# EAGLE design APA106_layout_test (EAGLE 7.4.0)
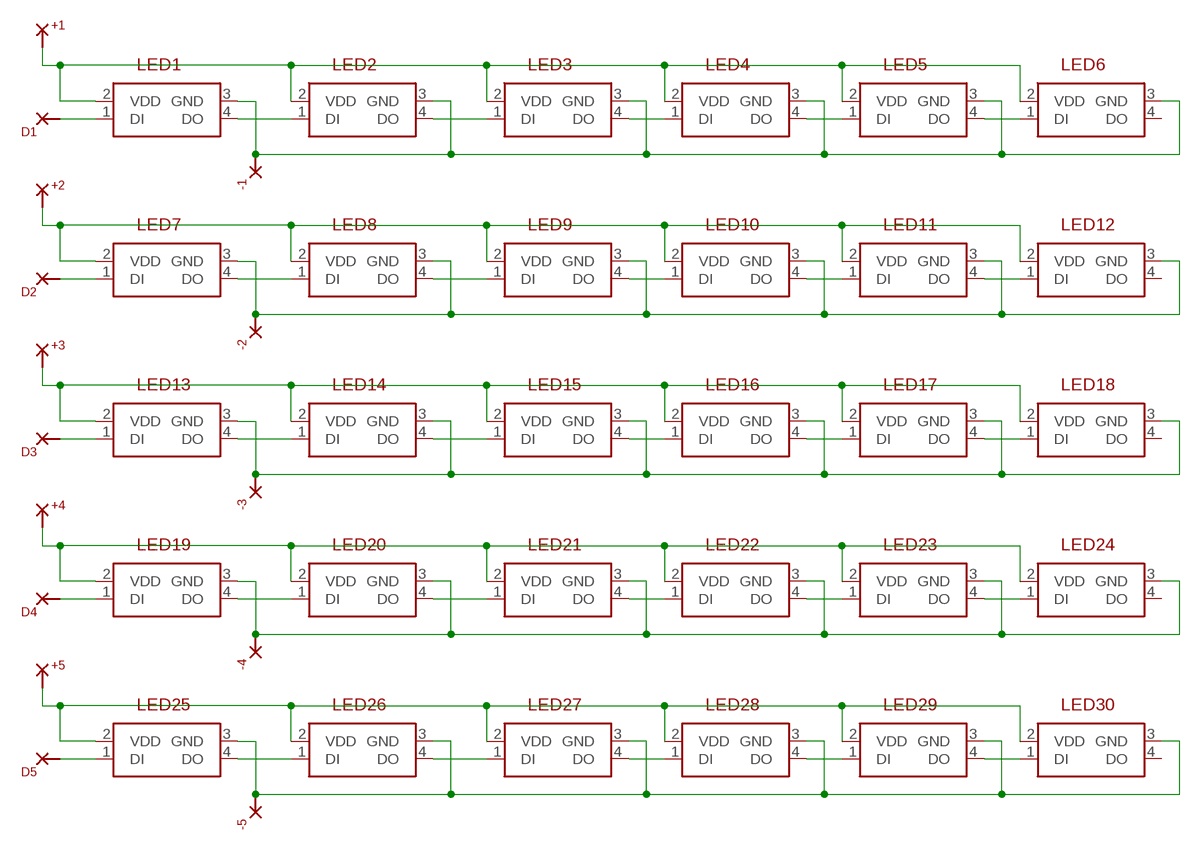
[diagram p0: schematic, sheet 1]

## Parts
+1  WIRE-TEST-LOOP  [WIRE-TEST-LOOP]
+2  WIRE-TEST-LOOP  [WIRE-TEST-LOOP]
+3  WIRE-TEST-LOOP  [WIRE-TEST-LOOP]
+4  WIRE-TEST-LOOP  [WIRE-TEST-LOOP]
+5  WIRE-TEST-LOOP  [WIRE-TEST-LOOP]
-1  WIRE-TEST-LOOP  [WIRE-TEST-LOOP]
-2  WIRE-TEST-LOOP  [WIRE-TEST-LOOP]
-3  WIRE-TEST-LOOP  [WIRE-TEST-LOOP]
-4  WIRE-TEST-LOOP  [WIRE-TEST-LOOP]
-5  WIRE-TEST-LOOP  [WIRE-TEST-LOOP]
D1  WIRE-TEST-LOOP  [WIRE-TEST-LOOP]
D2  WIRE-TEST-LOOP  [WIRE-TEST-LOOP]
D3  WIRE-TEST-LOOP  [WIRE-TEST-LOOP]
D4  WIRE-TEST-LOOP  [WIRE-TEST-LOOP]
D5  WIRE-TEST-LOOP  [WIRE-TEST-LOOP]
LED1  LED-APA106HOLE-OFFSET-SPREAD  [LED-5MM-4PIN-HOLE-OFFSET-SPREAD]
LED2  LED-APA106HOLE-OFFSET-SPREAD  [LED-5MM-4PIN-HOLE-OFFSET-SPREAD]
LED3  LED-APA106HOLE-OFFSET-SPREAD  [LED-5MM-4PIN-HOLE-OFFSET-SPREAD]
LED4  LED-APA106HOLE-OFFSET-SPREAD  [LED-5MM-4PIN-HOLE-OFFSET-SPREAD]
LED5  LED-APA106HOLE-OFFSET-SPREAD  [LED-5MM-4PIN-HOLE-OFFSET-SPREAD]
LED6  LED-APA106HOLE-OFFSET-SPREAD  [LED-5MM-4PIN-HOLE-OFFSET-SPREAD]
LED7  LED-APA106SPREAD  [LED-5MM-4PIN-SPREAD]
LED8  LED-APA106SPREAD  [LED-5MM-4PIN-SPREAD]
LED9  LED-APA106SPREAD  [LED-5MM-4PIN-SPREAD]
LED10  LED-APA106SPREAD  [LED-5MM-4PIN-SPREAD]
LED11  LED-APA106SPREAD  [LED-5MM-4PIN-SPREAD]
LED12  LED-APA106SPREAD  [LED-5MM-4PIN-SPREAD]
LED13  LED-APA106OFFSET  [LED-5MM-4PIN-OFFSET]
LED14  LED-APA106OFFSET  [LED-5MM-4PIN-OFFSET]
LED15  LED-APA106OFFSET  [LED-5MM-4PIN-OFFSET]
LED16  LED-APA106OFFSET  [LED-5MM-4PIN-OFFSET]
LED17  LED-APA106OFFSET  [LED-5MM-4PIN-OFFSET]
LED18  LED-APA106OFFSET  [LED-5MM-4PIN-OFFSET]
LED19  LED-APA106SPREAD-OFFSET  [LED-5MM-4PIN-SPREAD-OFFSET]
LED20  LED-APA106SPREAD-OFFSET  [LED-5MM-4PIN-SPREAD-OFFSET]
LED21  LED-APA106SPREAD-OFFSET  [LED-5MM-4PIN-SPREAD-OFFSET]
LED22  LED-APA106SPREAD-OFFSET  [LED-5MM-4PIN-SPREAD-OFFSET]
LED23  LED-APA106SPREAD-OFFSET  [LED-5MM-4PIN-SPREAD-OFFSET]
LED24  LED-APA106SPREAD-OFFSET  [LED-5MM-4PIN-SPREAD-OFFSET]
LED25  LED-APA106HOLE-OFFSET  [LED-5MM-4PIN-HOLE-OFFSET]
LED26  LED-APA106HOLE-OFFSET  [LED-5MM-4PIN-HOLE-OFFSET]
LED27  LED-APA106HOLE-OFFSET  [LED-5MM-4PIN-HOLE-OFFSET]
LED28  LED-APA106HOLE-OFFSET  [LED-5MM-4PIN-HOLE-OFFSET]
LED29  LED-APA106HOLE-OFFSET  [LED-5MM-4PIN-HOLE-OFFSET]
LED30  LED-APA106HOLE-OFFSET  [LED-5MM-4PIN-HOLE-OFFSET]

## Nets
DI-SPREAD: D2.HOLE1 D2.HOLE2 D2.PAD LED7.1(DI)
DI-SPREAD1: D3.HOLE1 D3.HOLE2 D3.PAD LED13.1(DI)
DI-SPREAD2: D4.HOLE1 D4.HOLE2 D4.PAD LED19.1(DI)
DI-SPREAD3: D5.HOLE1 D5.HOLE2 D5.PAD LED25.1(DI)
DI-STANDARD: D1.HOLE1 D1.HOLE2 D1.PAD LED1.1(DI)
GND1: -1.HOLE1 -1.HOLE2 -1.PAD LED1.3(GND) LED2.3(GND) LED3.3(GND) LED4.3(GND) LED5.3(GND) LED6.3(GND)
GND2: -2.HOLE1 -2.HOLE2 -2.PAD LED7.3(GND) LED8.3(GND) LED9.3(GND) LED10.3(GND) LED11.3(GND) LED12.3(GND)
GND3: -3.HOLE1 -3.HOLE2 -3.PAD LED13.3(GND) LED14.3(GND) LED15.3(GND) LED16.3(GND) LED17.3(GND) LED18.3(GND)
GND4: -4.HOLE1 -4.HOLE2 -4.PAD LED19.3(GND) LED20.3(GND) LED21.3(GND) LED22.3(GND) LED23.3(GND) LED24.3(GND)
N$1: LED1.4(DO) LED2.1(DI)
N$3: LED7.4(DO) LED8.1(DI)
N$4: LED2.4(DO) LED3.1(DI)
N$5: LED3.4(DO) LED4.1(DI)
N$6: LED4.4(DO) LED5.1(DI)
N$7: LED5.4(DO) LED6.1(DI)
N$8: LED13.4(DO) LED14.1(DI)
N$9: LED8.4(DO) LED9.1(DI)
N$10: LED9.4(DO) LED10.1(DI)
N$11: LED10.4(DO) LED11.1(DI)
N$12: LED11.4(DO) LED12.1(DI)
N$13: LED14.4(DO) LED15.1(DI)
N$15: LED15.4(DO) LED16.1(DI)
N$16: LED16.4(DO) LED17.1(DI)
N$17: LED17.4(DO) LED18.1(DI)
N$19: LED19.4(DO) LED20.1(DI)
N$20: LED20.4(DO) LED21.1(DI)
N$21: LED21.4(DO) LED22.1(DI)
N$22: LED22.4(DO) LED23.1(DI)
N$23: LED23.4(DO) LED24.1(DI)
N$25: LED25.4(DO) LED26.1(DI)
N$26: LED26.4(DO) LED27.1(DI)
N$27: LED27.4(DO) LED28.1(DI)
N$28: LED28.4(DO) LED29.1(DI)
N$29: LED29.4(DO) LED30.1(DI)
VDD1: +1.HOLE1 +1.HOLE2 +1.PAD LED1.2(VDD) LED2.2(VDD) LED3.2(VDD) LED4.2(VDD) LED5.2(VDD) LED6.2(VDD)
VDD2: +2.HOLE1 +2.HOLE2 +2.PAD LED7.2(VDD) LED8.2(VDD) LED9.2(VDD) LED10.2(VDD) LED11.2(VDD) LED12.2(VDD)
VDD3: +3.HOLE1 +3.HOLE2 +3.PAD LED13.2(VDD) LED14.2(VDD) LED15.2(VDD) LED16.2(VDD) LED17.2(VDD) LED18.2(VDD)
VDD4: +4.HOLE1 +4.HOLE2 +4.PAD LED19.2(VDD) LED20.2(VDD) LED21.2(VDD) LED22.2(VDD) LED23.2(VDD) LED24.2(VDD)
VDD5: +5.HOLE1 +5.HOLE2 +5.PAD LED25.2(VDD) LED26.2(VDD) LED27.2(VDD) LED28.2(VDD) LED29.2(VDD) LED30.2(VDD)
VND5: -5.HOLE1 -5.HOLE2 -5.PAD LED25.3(GND) LED26.3(GND) LED27.3(GND) LED28.3(GND) LED29.3(GND) LED30.3(GND)
Unconnected: LED6.4(DO) LED12.4(DO) LED18.4(DO) LED24.4(DO) LED30.4(DO)

## Library data of the parts
+1-+5 -1--5 D1-D5 = scotty:WIRE-TEST-LOOP
LED1-LED30 = scotty:LED-APA106

## Board
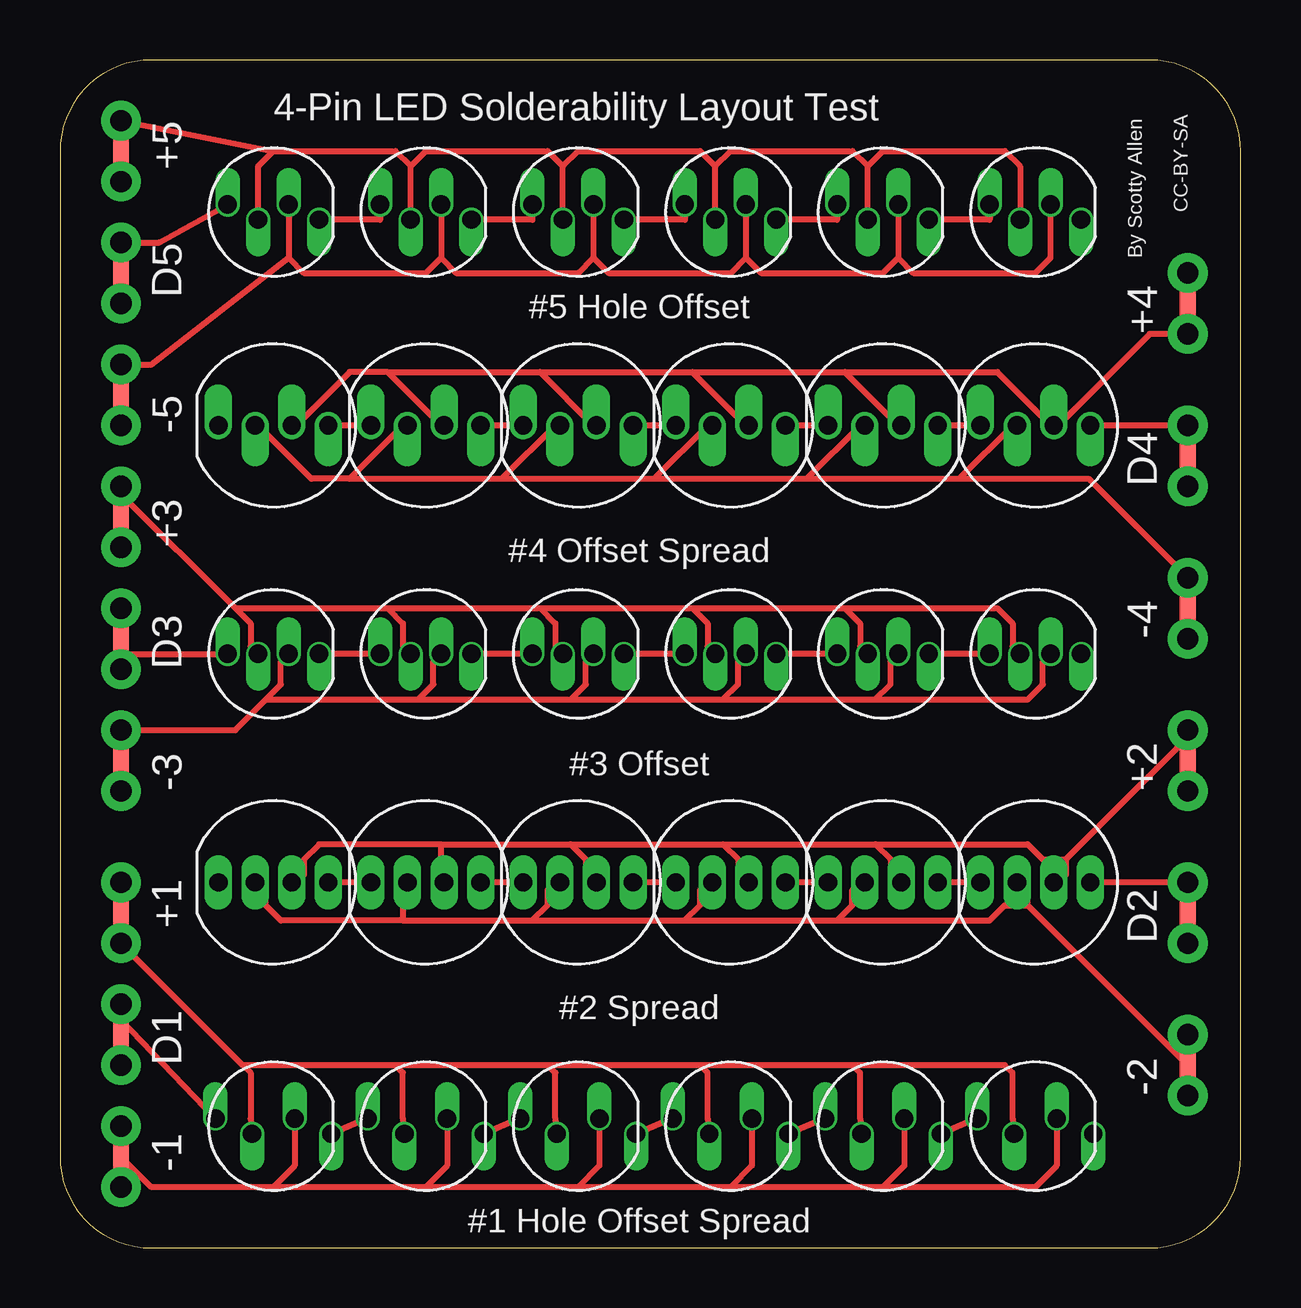
[diagram p1: board, top side]
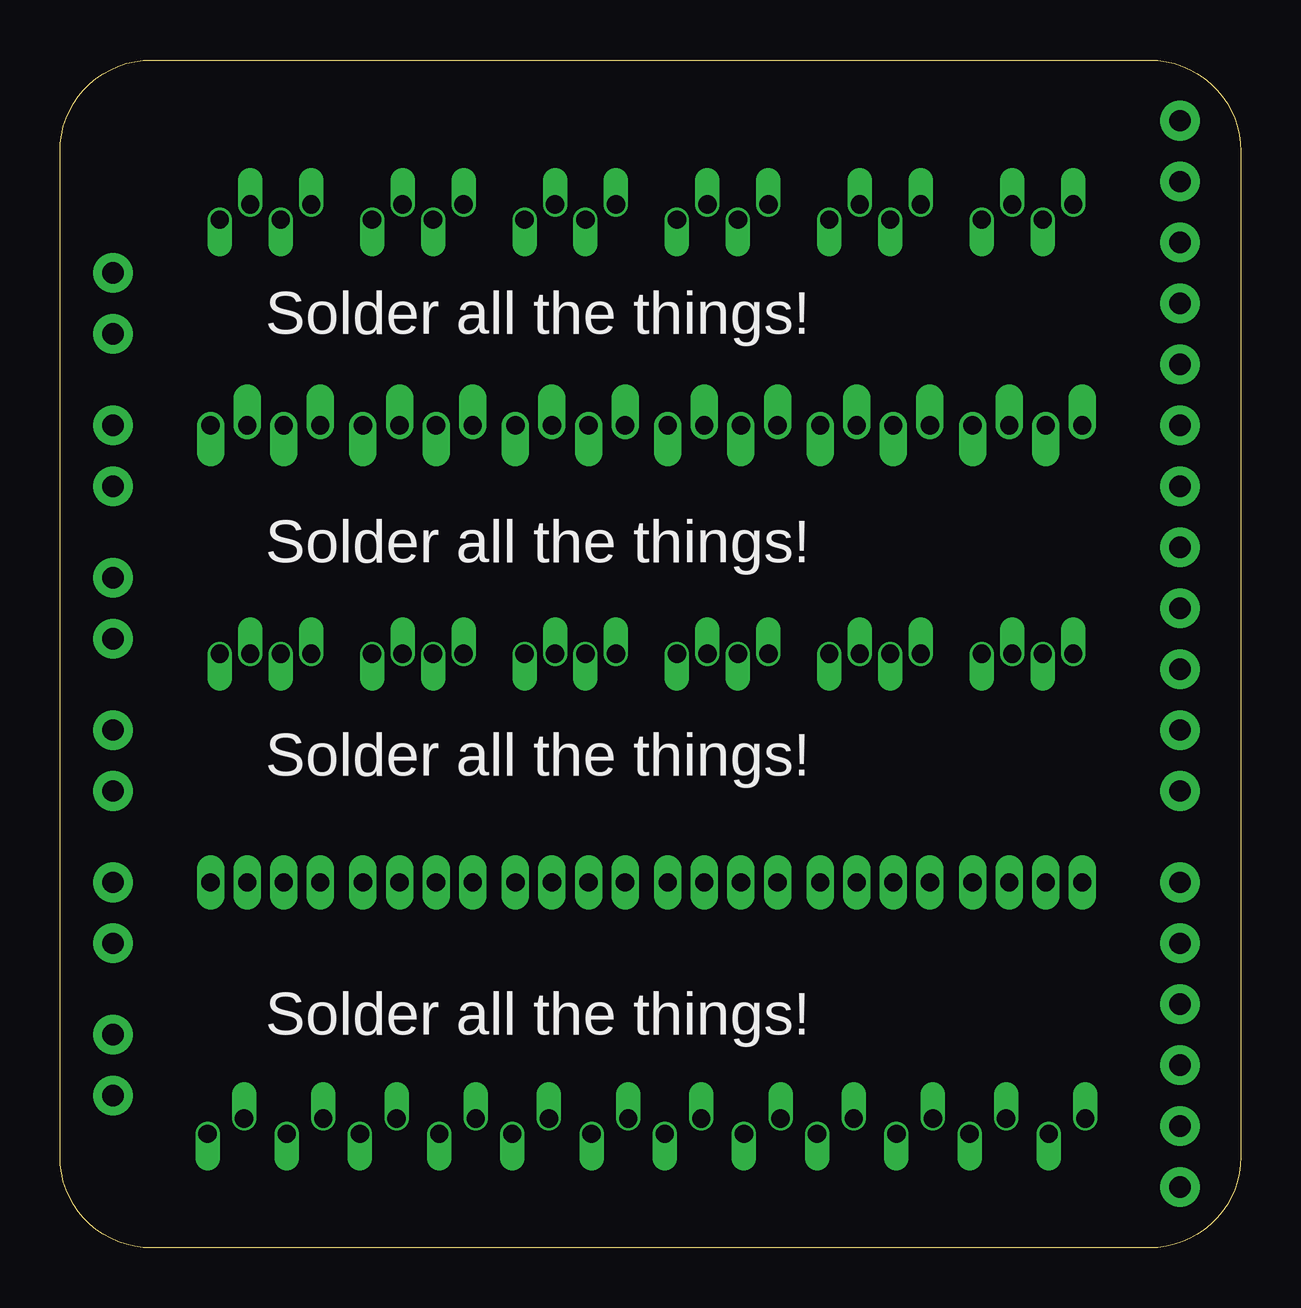
[diagram p2: board, bottom side, seen from below]

Size 49.2 x 49.52 mm. Coordinates in mm from the lower left corner, seen from the top.
Outline: 49.2,3.81 49.2,45.71 arc90 45.39,49.52 3.81,49.52 arc90 0,45.71 0,3.81 arc90 3.81,0 45.39,0 arc90 49.2,3.81
Copper layers (1*16): Top 0.035mm / dielectric 1.5mm / Bottom 0.035mm
Design rules "default *": minimum track width 10mil, minimum drill 24mil, track to track 8mil, track to pad 8mil, pad to pad 8mil, via to via 8mil, smd to smd 8mil, copper to edge 40mil, drill to drill 8mil, minimum pad ring 4mil, minimum via ring 8mil, stop-mask expansion 4mil, vias tented up to drill 0mil, thermal gap 10mil

### Footprints (pad centres in the part's own frame; a part is rotated, then mirrored left to right if it is on the bottom)
WIRE-TEST-LOOP = drill 0.889 pad 1.651: HOLE1 -1.27,0; HOLE2 1.27,0 | smd 1.27 x 0.66: PAD 0,0
LED-5MM-4PIN-HOLE-OFFSET-SPREAD = drill 0.762 pad 1.016 offset: 1 -2.413,0.318; 2 -0.889,-0.318; 3 0.889,0.318; 4 2.413,-0.318
LED-5MM-4PIN-SPREAD = drill 0.762 pad 1.143 long: 1 -2.286,0; 2 -0.762,0; 3 0.762,0; 4 2.286,0
LED-5MM-4PIN-OFFSET = drill 0.762 pad 1.016 offset: 1 -1.905,0; 2 -0.635,0; 3 0.635,0; 4 1.905,0
LED-5MM-4PIN-SPREAD-OFFSET = drill 0.762 pad 1.143 offset: 1 -2.286,0; 2 -0.762,0; 3 0.762,0; 4 2.286,0
LED-5MM-4PIN-HOLE-OFFSET = drill 0.762 pad 1.016 offset: 1 -1.905,0.318; 2 -0.635,-0.318; 3 0.635,0.318; 4 1.905,-0.318

### Placement (x,y rotation side)
+1  2.54,13.97 270 top
+2  46.99,20.32 90 top
+3  2.54,30.48 90 top
+4  46.99,39.37 90 top
+5  2.54,45.72 270 top
-1  2.54,3.81 270 top
-2  46.99,7.62 90 top
-3  2.54,20.32 90 top
-4  46.99,26.67 90 top
-5  2.54,35.56 270 top
D1  2.54,8.89 270 top
D2  46.99,13.97 90 top
D3  2.54,25.4 90 top
D4  46.99,33.02 90 top
D5  2.54,40.64 270 top
LED1  8.89,5.08 0 top
LED2  15.24,5.08 0 top
LED3  21.59,5.08 0 top
LED4  27.94,5.08 0 top
LED5  34.29,5.08 0 top
LED6  40.64,5.08 0 top
LED7  40.64,15.24 180 top
LED8  34.29,15.24 180 top
LED9  27.94,15.24 180 top
LED10  21.59,15.24 180 top
LED11  15.24,15.24 180 top
LED12  8.89,15.24 180 top
LED13  8.89,24.77 0 top
LED14  15.24,24.77 0 top
LED15  21.59,24.77 0 top
LED16  27.94,24.77 0 top
LED17  34.29,24.77 0 top
LED18  40.64,24.77 0 top
LED19  40.64,34.29 180 top
LED20  34.29,34.29 180 top
LED21  27.94,34.29 180 top
LED22  21.59,34.29 180 top
LED23  15.24,34.29 180 top
LED24  8.89,34.29 180 top
LED25  8.89,43.18 0 top
LED26  15.24,43.18 0 top
LED27  21.59,43.18 0 top
LED28  27.94,43.18 0 top
LED29  34.29,43.18 0 top
LED30  40.64,43.18 0 top

### Tracks (layer width: path | path; a pad name or v marks a point on that pad's centre or on a via)
DI-SPREAD
  Top 0.254: LED7.1 D2.HOLE2 D2.PAD D2.HOLE1
DI-SPREAD1
  Top 0.254: D3.HOLE2 D3.PAD 2.54,24.77 | 2.54,24.77 LED13.1 | 2.54,24.77 D3.HOLE1
DI-SPREAD2
  Top 0.254: LED19.1 D4.HOLE2 D4.PAD D4.HOLE1
DI-SPREAD3
  Top 0.254: D5.HOLE2 D5.PAD D5.HOLE1 4.13,41.91 LED25.1
DI-STANDARD
  Top 0.254: 2.54,9.53 D1.PAD D1.HOLE2 | 2.54,9.53 LED1.1 | 2.54,9.53 D1.HOLE1
GND1
  Top 0.254: -1.HOLE1 -1.PAD | -1.PAD -1.HOLE2 | LED1.3 9.78,3.43 8.89,2.54 | 8.89,2.54 3.81,2.54 -1.PAD | LED2.3 16.13,3.43 15.24,2.54 | 15.24,2.54 8.89,2.54 | LED3.3 22.48,3.43 21.59,2.54 | 21.59,2.54 15.24,2.54 | LED4.3 28.83,3.43 27.94,2.54 | 27.94,2.54 21.59,2.54 | LED5.3 35.18,3.43 34.29,2.54 | 34.29,2.54 27.94,2.54 | LED6.3 41.53,3.43 40.64,2.54 34.29,2.54
GND2
  Top 0.254: -2.HOLE2 -2.PAD | 40.32,14.29 40.32,14.92 40.01,15.24 LED7.3 | -2.PAD 40.32,14.29 | -2.PAD -2.HOLE1 | 14.29,13.65 9.21,13.65 8.57,14.29 8.57,14.92 8.26,15.24 LED12.3 | 14.29,13.65 14.29,15.24 LED11.3 | 19.68,13.65 20.32,14.29 20.32,14.92 20.64,15.24 LED10.3 | 14.29,13.65 19.68,13.65 | 26.04,13.65 26.67,14.29 26.67,14.92 26.99,15.24 LED9.3 | 19.68,13.65 26.04,13.65 | 32.38,13.65 33.02,14.29 33.02,14.92 33.34,15.24 LED8.3 | 26.04,13.65 32.38,13.65 | 40.32,14.29 39.37,14.29 38.73,13.65 32.38,13.65
GND3
  Top 0.254: LED13.3 9.21,24.45 9.21,23.5 8.57,22.86 | 8.57,22.86 7.3,21.59 -3.HOLE2 -3.PAD -3.HOLE1 | LED14.3 15.56,24.45 15.56,23.5 14.92,22.86 | 8.57,22.86 14.92,22.86 | LED15.3 21.91,24.45 21.91,23.5 21.27,22.86 | 14.92,22.86 21.27,22.86 | LED16.3 28.26,24.45 28.26,23.5 27.62,22.86 | 21.27,22.86 27.62,22.86 | LED17.3 34.61,24.45 34.61,23.5 33.97,22.86 | 27.62,22.86 33.97,22.86 | LED18.3 40.96,24.45 40.96,23.5 40.32,22.86 33.97,22.86
GND4
  Top 0.254: -4.HOLE1 -4.PAD -4.HOLE2 42.86,32.07 37.47,32.07 | 12.06,32.07 10.48,32.07 8.26,34.29 LED24.3 | 12.06,32.07 14.29,34.29 LED23.3 | 18.41,32.07 20.64,34.29 LED22.3 | 12.06,32.07 18.41,32.07 | 24.77,32.07 26.99,34.29 LED21.3 | 18.41,32.07 24.77,32.07 | 31.11,32.07 33.34,34.29 LED20.3 | 24.77,32.07 31.11,32.07 | 37.47,32.07 39.69,34.29 LED19.3 | 31.11,32.07 37.47,32.07
N$1
  Top 0.254: LED2.1 LED1.4
N$3
  Top 0.254: LED7.4 LED8.1
N$4
  Top 0.254: LED3.1 LED2.4
N$5
  Top 0.254: LED4.1 LED3.4
N$6
  Top 0.254: LED5.1 LED4.4
N$7
  Top 0.254: LED6.1 LED5.4
N$8
  Top 0.254: LED14.1 LED13.4
N$9
  Top 0.254: LED8.4 LED9.1
N$10
  Top 0.254: LED9.4 LED10.1
N$11
  Top 0.254: LED10.4 LED11.1
N$12
  Top 0.254: LED11.4 LED12.1
N$13
  Top 0.254: LED15.1 LED14.4
N$15
  Top 0.254: LED16.1 LED15.4
N$16
  Top 0.254: LED17.1 LED16.4
N$17
  Top 0.254: LED18.1 LED17.4
N$19
  Top 0.254: LED19.4 LED20.1
N$20
  Top 0.254: LED20.4 LED21.1
N$21
  Top 0.254: LED21.4 LED22.1
N$22
  Top 0.254: LED22.4 LED23.1
N$23
  Top 0.254: LED23.4 LED24.1
N$25
  Top 0.254: LED25.4 13.34,42.86 LED26.1
N$26
  Top 0.254: LED26.4 19.68,42.86 LED27.1
N$27
  Top 0.254: LED27.4 26.04,42.86 LED28.1
N$28
  Top 0.254: LED28.4 32.38,42.86 LED29.1
N$29
  Top 0.254: LED29.4 38.73,42.86 LED30.1
VDD1
  Top 0.254: +1.HOLE1 +1.PAD +1.HOLE2 7.62,7.62 | LED1.2 7.94,5.4 7.94,7.3 7.62,7.62 | LED2.2 14.29,5.4 14.29,7.3 13.97,7.62 | LED3.2 20.64,5.4 20.64,7.3 20.32,7.62 | LED4.2 26.99,5.4 26.99,7.3 26.67,7.62 | LED5.2 33.34,5.4 33.34,7.3 33.02,7.62 | LED6.2 39.69,5.4 39.69,7.3 39.37,7.62 33.02,7.62 | 13.97,7.62 7.62,7.62 | 20.32,7.62 13.97,7.62 | 26.67,7.62 20.32,7.62 | 33.02,7.62 31.75,7.62 26.67,7.62
VDD2
  Top 0.254: 46.99,21.27 +2.PAD +2.HOLE1 | 41.91,16.19 41.91,15.56 41.59,15.24 LED7.2 | 46.99,21.27 41.91,16.19 | 46.99,21.27 +2.HOLE2 | 15.88,16.83 10.79,16.83 10.16,16.19 10.16,15.56 9.84,15.24 LED12.2 | 15.88,16.83 15.88,15.24 LED11.2 | 21.27,16.83 21.91,16.19 21.91,15.56 22.23,15.24 LED10.2 | 15.88,16.83 21.27,16.83 | 27.62,16.83 28.26,16.19 28.26,15.56 28.57,15.24 LED9.2 | 21.27,16.83 27.62,16.83 | 33.97,16.83 34.61,16.19 34.61,15.56 34.92,15.24 LED8.2 | 27.62,16.83 33.97,16.83 | 41.91,16.19 40.96,16.19 40.32,16.83 33.97,16.83
VDD3
  Top 0.254: 2.54,31.43 +3.PAD +3.HOLE1 | LED13.2 7.94,25.08 7.94,26.04 7.3,26.67 | 2.54,31.43 7.3,26.67 | 2.54,31.43 +3.HOLE2 | LED14.2 14.29,25.08 14.29,26.04 13.65,26.67 | 7.3,26.67 13.65,26.67 | LED15.2 20.64,25.08 20.64,26.04 20,26.67 | 13.65,26.67 20,26.67 | LED16.2 26.99,25.08 26.99,26.04 26.35,26.67 | 20,26.67 26.35,26.67 | LED17.2 33.34,25.08 33.34,26.04 32.7,26.67 | 26.35,26.67 32.7,26.67 | LED18.2 39.69,25.08 39.69,26.04 39.05,26.67 32.7,26.67
VDD4
  Top 0.254: +4.HOLE2 +4.PAD +4.HOLE1 45.4,38.1 41.59,34.29 LED19.2 41.27,34.29 39.05,36.51 32.7,36.51 | 13.65,36.51 12.06,36.51 9.84,34.29 LED24.2 | 13.65,36.51 15.88,34.29 LED23.2 | 20,36.51 22.23,34.29 LED22.2 | 13.65,36.51 20,36.51 | 26.35,36.51 28.57,34.29 LED21.2 | 20,36.51 26.35,36.51 | 32.7,36.51 34.92,34.29 LED20.2 | 26.35,36.51 32.7,36.51
VDD5
  Top 0.254: +5.PAD +5.HOLE2 +5.HOLE1 8.89,45.72 | LED25.2 8.26,45.09 8.89,45.72 | 8.89,45.72 13.97,45.72 14.61,45.09 | LED26.2 14.61,45.09 | 14.61,45.09 15.24,45.72 20.32,45.72 20.95,45.09 | LED27.2 20.95,45.09 | 20.95,45.09 21.59,45.72 26.67,45.72 27.3,45.09 | LED28.2 27.3,45.09 | 27.3,45.09 27.94,45.72 33.02,45.72 33.66,45.09 | LED29.2 33.66,45.09 | 33.66,45.09 34.29,45.72 39.37,45.72 40.01,45.09 LED30.2
VND5
  Top 0.254: -5.HOLE2 -5.PAD -5.HOLE1 3.81,36.83 9.53,41.27 | LED25.3 9.53,41.27 | 9.53,41.27 10.16,40.64 15.24,40.64 15.88,41.27 | LED26.3 15.88,41.27 | 15.88,41.27 16.51,40.64 21.59,40.64 22.23,41.27 | LED27.3 22.23,41.27 | 22.23,41.27 22.86,40.64 27.94,40.64 28.57,41.27 | LED28.3 28.57,41.27 | 28.57,41.27 29.21,40.64 34.29,40.64 34.92,41.27 | LED29.3 34.92,41.27 | 34.92,41.27 35.56,40.64 40.64,40.64 41.27,41.27 LED30.3

### Text on the board
tPlace: 4-Pin LED Solderability Layout Test | CC-BY-SA | By Scotty Allen | #5 Hole Offset | #4 Offset Spread | #3 Offset | #2 Spread | #1 Hole Offset Spread
bPlace: Solder all the things! | Solder all the things! | Solder all the things! | Solder all the things!